# EAGLE schematic Motorsteuerung_v3 (EAGLE 9.6.0)
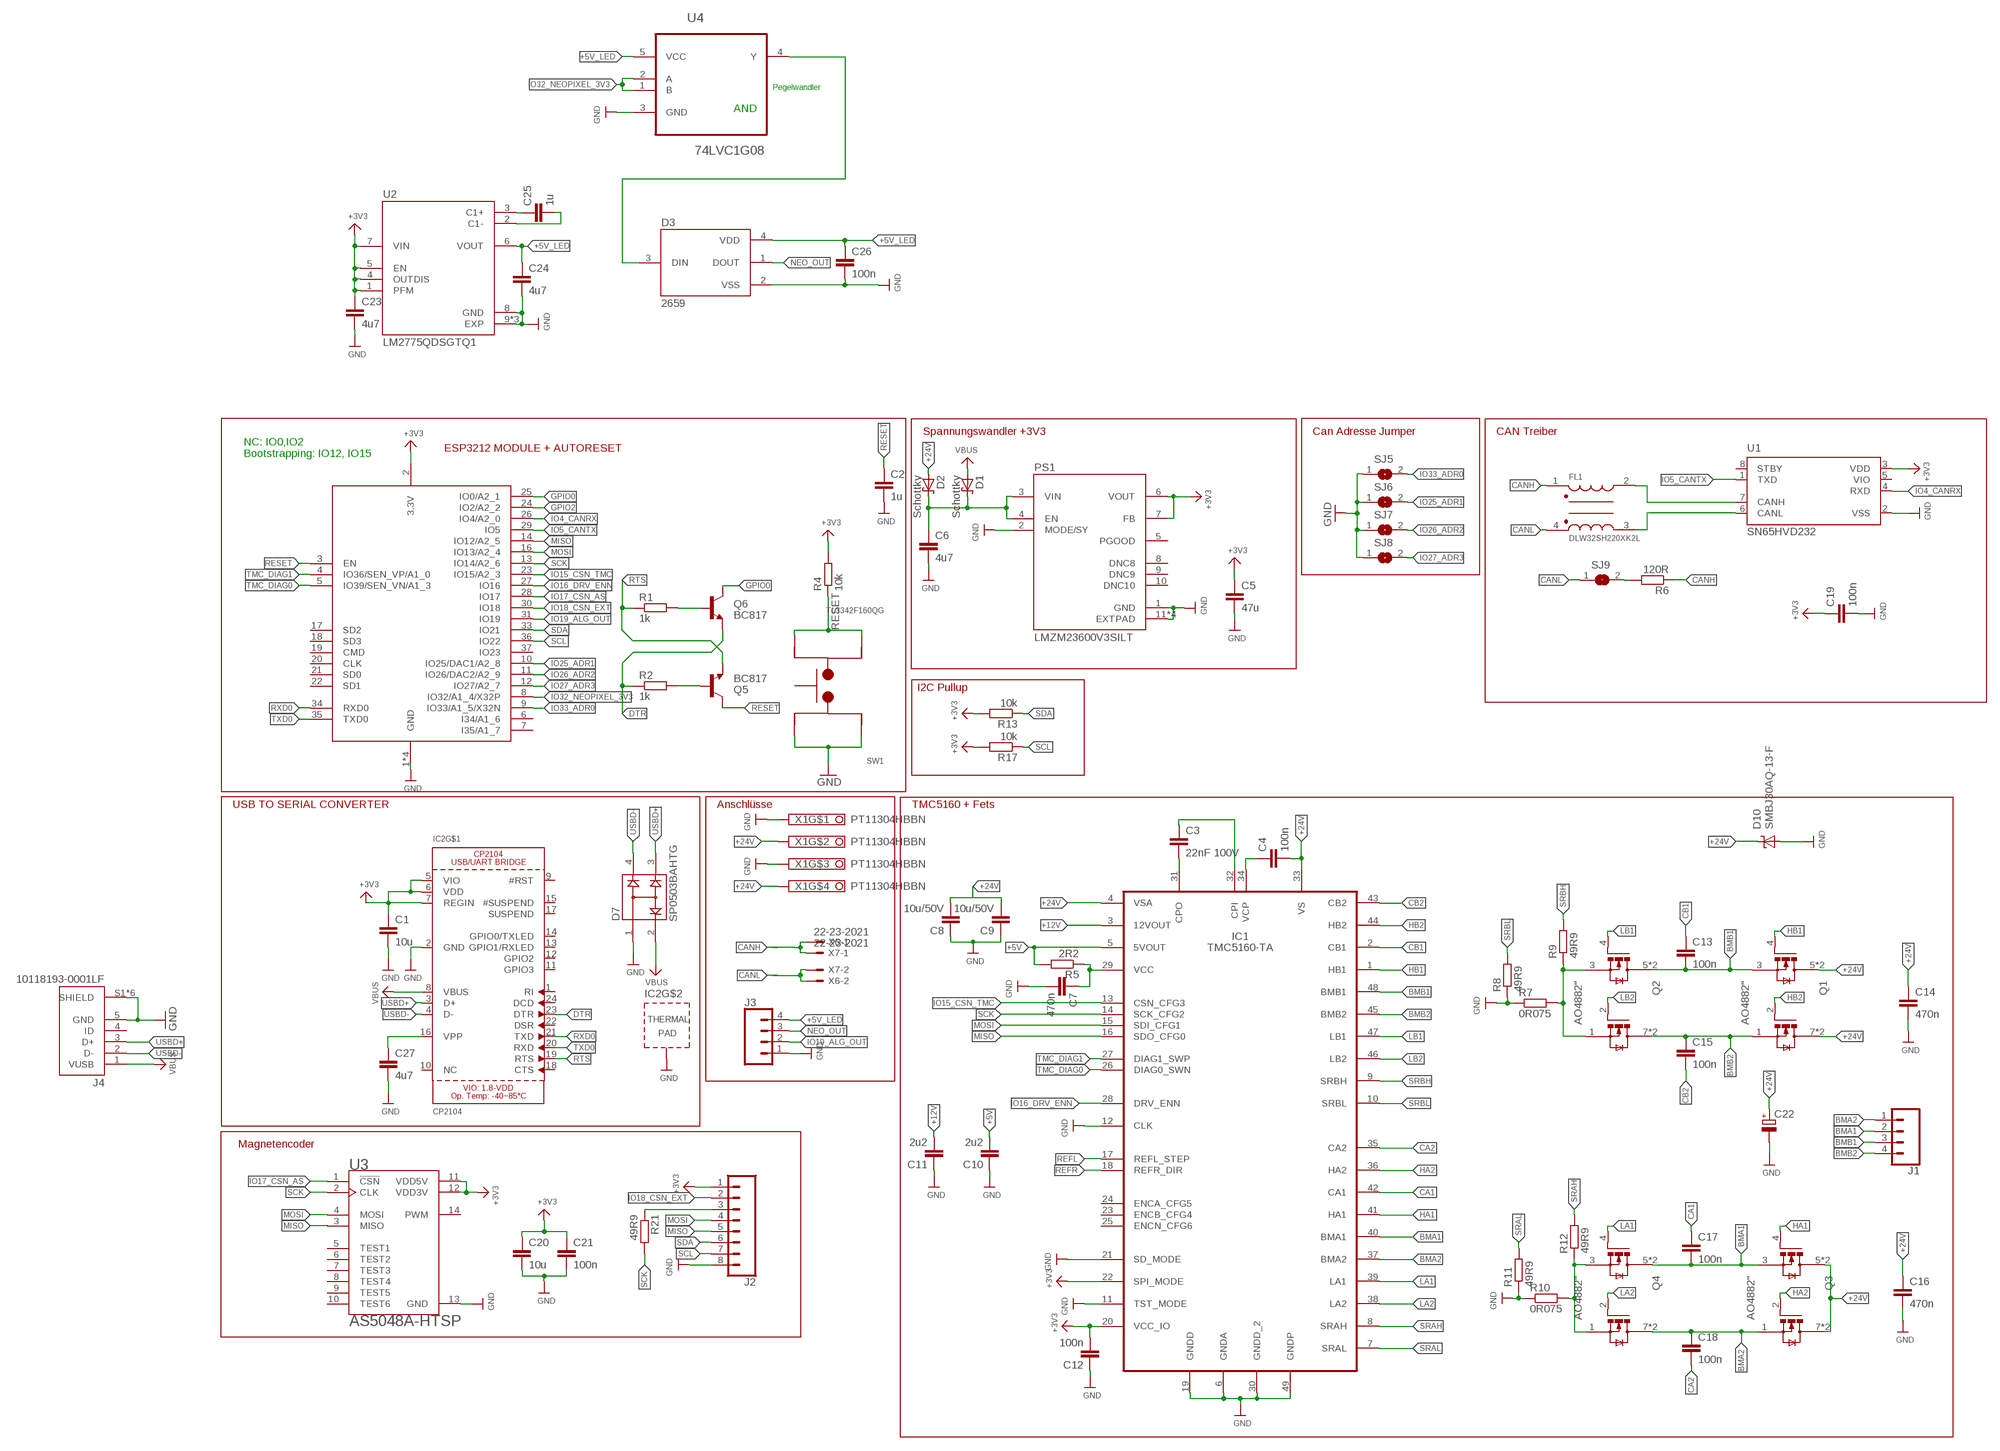
[diagram p0: schematic, sheet 1]

## Parts
C1  10u  C-EUC0805  [C0805]
C2  1u  C-EUC0805  [C0805]
C3  22nF 100V  C-EUC0805  [C0805]
C4  100n  C-EUC0805  [C0805]
C5  47u  C-EUC0805  [C0805]
C6  4u7  C-EUC0805  [C0805]
C7  470n  C-EUC0805  [C0805]
C8  10u/50V  C-EUC0805  [C0805]
C9  10u/50V  C-EUC0805  [C0805]
C10  2u2  C-EUC0805  [C0805]
C11  2u2  C-EUC0805  [C0805]
C12  100n  C-EUC0805  [C0805]
C13  100n  C-EUC0805  [C0805]
C14  470n  C-EUC0805  [C0805]
C15  100n  C-EUC0805  [C0805]
C16  470n  C-EUC0805  [C0805]
C17  100n  C-EUC0805  [C0805]
C18  100n  C-EUC0805  [C0805]
C19  100n  C-EUC0805  [C0805]
C20  10u  C-EUC0805  [C0805]
C21  100n  C-EUC0805  [C0805]
C22  CPOL-EUE5-10.5  [E5-10,5]
C23  4u7  C-EUC0805  [C0805]
C24  4u7  C-EUC0805  [C0805]
C25  1u  C-EUC0805  [C0805]
C26  100n  C-EUC0805  [C0805]
C27  4u7  C-EUC0805  [C0805]
D1  Schottky  SCHOTTKY-DIODESMD  [SMB]
D2  Schottky  SCHOTTKY-DIODESMD  [SMB]
D3  2659  [2659]
D7  SP0503BAHTG  [SOT143]
D10  SMBJ30AQ-13-F  SUPPRESSOR-SMBJ  [SMBJ]
FL1  DLW32SH220XK2L  DLW32SH110XK2L  [FIL_DLW32SH110XK2L]
IC1  TMC5160-TA  [TQFP48-EP]
IC2  CP2104  [QFN24_4MM_SMSC]
J1  CONN_04  [1X04]
J2  CONN_08BM08B-SRSS-TB  [BM08B-SRSS-TB]
J3  CONN_041.27MM  [1X04_1.27MM]
J4  10118193-0001LF  [FCI_10118193-0001LF]
PS1  LMZM23600V3SILT  [CONV_LMZM23600V3SILT]
Q1  AO4882"  [SOIC8]
Q2  AO4882"  [SOIC8]
Q3  AO4882"  [SOIC8]
Q4  AO4882"  [SOIC8]
Q5  BC817  TRANSISTOR_NPNSOT23-3  [SOT23-3]
Q6  BC817  TRANSISTOR_NPNSOT23-3  [SOT23-3]
R1  1k  R-EU_R0805  [R0805]
R2  1k  R-EU_R0805  [R0805]
R4  10k  R-EU_R0805  [R0805]
R5  2R2  R-EU_R0805  [R0805]
R6  120R  R-EU_R0805  [R0805]
R7  0R075  R-EU_R1206  [R1206]
R8  49R9  R-EU_R0805  [R0805]
R9  49R9  R-EU_R0805  [R0805]
R10  0R075  R-EU_R1206  [R1206]
R11  49R9  R-EU_R0805  [R0805]
R12  49R9  R-EU_R0805  [R0805]
R13  10k  R-EU_R0805  [R0805]
R17  10k  R-EU_R0805  [R0805]
R21  49R9  R-EU_R0805  [R0805]
SJ5  SJ  [SJ]
SJ6  SJ  [SJ]
SJ7  SJ  [SJ]
SJ8  SJ  [SJ]
SJ9  SJ  [SJ]
SW1  TL3342F160QG  [SW_TL3342F160QG]
U1  SN65HVD232  MCP2562-E/SN  [SOIC127P600X175-8N]
U2  LM2775QDSGTQ1  [SON50P200X200X80-9N]
U3  AS5048A-HTSP  [SOP65P640X120-14N]
U4  74LVC1G08  74LVC1G00GW  [SOT65P210X110-5N]
X1  PT11304HBBN  TYP184  [TYP184_FT]
X2  ESP32_WROOM32_SKINNY  [WROOM32_SKINNY]
X6  22-23-2021  [22-23-2021]
X7  22-23-2021  [22-23-2021]

## Nets
+3V3: C1.1 C5.1 C12.2 C19.1 C20.1 C21.1 C23.1 IC1.20(VCC_IO) IC1.22(SPI_MODE) IC2.5(VIO) IC2.6(VDD) IC2.7(REGIN) J2.1 PS1.6(VOUT) PS1.7(FB) R4.2 R13.2 R17.2 U1.3(VDD) U2.1(PFM) U2.4(OUTDIS) U2.5(EN) U2.7(VIN) U3.11(VDD5V) U3.12(VDD3V) X2.2(3.3V)
+5V: C10.2 IC1.5(5VOUT) R5.2
+5V_LED: C24.1 C26.1 D3.4(VDD) J3.4 U2.6(VOUT) U4.5(VCC)
+12V: C11.2 IC1.3(12VOUT)
+24V: C4.2 C8.2 C9.2 C14.1 C16.1 C22.+ D2.A D10.C IC1.4(VSA) IC1.33(VS) Q1.5(D1) Q1.6(D1) Q1.7(D2) Q1.8(D2) Q3.5(D1) Q3.6(D1) Q3.7(D2) Q3.8(D2) X1.2 X1.4
BMA1: C17.2 IC1.40(BMA1) J1.2 Q3.3(S1) Q4.5(D1) Q4.6(D1)
BMA2: C18.1 IC1.37(BMA2) J1.1 Q3.1(S2) Q4.7(D2) Q4.8(D2)
BMB1: C13.2 IC1.48(BMB1) J1.3 Q1.3(S1) Q2.5(D1) Q2.6(D1)
BMB2: C15.1 IC1.45(BMB2) J1.4 Q1.1(S2) Q2.7(D2) Q2.8(D2)
CA1: C17.1 IC1.42(CA1)
CA2: C18.2 IC1.35(CA2)
CANH: FL1.1 R6.1 X6.1 X7.1
CANL: FL1.4 SJ9.1 X6.2 X7.2
CB1: C13.1 IC1.2(CB1)
CB2: C15.2 IC1.43(CB2)
DTR: IC2.23(DTR) Q6.2(E) R2.1
GND: C1.2 C2.2 C5.2 C6.2 C7.2 C8.1 C9.1 C10.1 C11.1 C12.1 C14.2 C16.2 C19.2 C20.2 C21.2 C22.- C23.2 C24.2 C26.2 C27.2 D3.2(VSS) D7.1 D10.A IC1.6(GNDA) IC1.11(TST_MODE) IC1.12(CLK) IC1.19(GNDD) IC1.21(SD_MODE) IC1.30(GNDD_2) IC1.49(GNDP) IC2.2(GND) IC2.THERM(TP) J2.8 J3.1 J4.5(GND) J4.S1(SHIELD) J4.S2(SHIELD) J4.S3(SHIELD) J4.S4(SHIELD) J4.S5(SHIELD) J4.S6(SHIELD) PS1.1(GND) PS1.2(MODE/SY) PS1.11(EXTPAD) PS1.11_1(EXTPAD) PS1.11_2(EXTPAD) PS1.11_3(EXTPAD) R7.1 R8.1 R10.1 R11.1 SJ5.1 SJ6.1 SJ7.1 SJ8.1 SW1.3 SW1.4 U1.2(VSS) U2.8(GND) U2.9(EXP) U2.9_1(EXP) U2.9_2(EXP) U3.13(GND) U4.3(GND) X1.1 X1.3 X2.1(GND) X2.15(GND) X2.38(GND) X2.P$1(GND)
GPIO0: Q6.3(C) X2.25(IO0/A2_1)
GPIO2: X2.24(IO2/A2_2)
HA1: IC1.41(HA1) Q3.4(G1)
HA2: IC1.36(HA2) Q3.2(G2)
HB1: IC1.1(HB1) Q1.4(G1)
HB2: IC1.44(HB2) Q1.2(G2)
IO4_CANRX: U1.4(RXD) X2.26(IO4/A2_0)
IO5_CANTX: U1.1(TXD) X2.29(IO5)
IO15_CSN_TMC: IC1.13(CSN_CFG3) X2.23(IO15/A2_3)
IO16_DRV_ENN: IC1.28(DRV_ENN) X2.27(IO16)
IO17_CSN_AS: U3.1(!CSN) X2.28(IO17)
IO18_CSN_EXT: J2.2 X2.30(IO18)
IO19_ALG_OUT: J3.2 X2.31(IO19)
IO25_ADR1: SJ6.2 X2.10(IO25/DAC1/A2_8)
IO26_ADR2: SJ7.2 X2.11(IO26/DAC2/A2_9)
IO27_ADR3: SJ8.2 X2.12(IO27/A2_7)
IO32_NEOPIXEL_3V3: U4.1(B) U4.2(A) X2.8(IO32/A1_4/X32P)
IO33_ADR0: SJ5.2 X2.9(IO33/A1_5/X32N)
LA1: IC1.39(LA1) Q4.4(G1)
LA2: IC1.38(LA2) Q4.2(G2)
LB1: IC1.47(LB1) Q2.4(G1)
LB2: IC1.46(LB2) Q2.2(G2)
MISO: IC1.16(SDO_CFG0) J2.5 U3.3(MISO) X2.14(IO12/A2_5)
MOSI: IC1.15(SDI_CFG1) J2.4 U3.4(MOSI) X2.16(IO13/A2_4)
N$1: C25.1 U2.3(C1+)
N$2: C6.1 D1.C D2.C PS1.3(VIN) PS1.4(EN)
N$3: C3.2 IC1.31(CPO)
N$4: C3.1 IC1.32(CPI)
N$5: C4.1 IC1.34(VCP)
N$6: C25.2 U2.2(C1-)
N$7: C7.1 IC1.29(VCC) R5.1
N$8: FL1.2 U1.7(CANH)
N$9: Q4.1(S2) Q4.3(S1) R10.2 R12.1
N$10: Q2.1(S2) Q2.3(S1) R7.2 R9.1
N$11: FL1.3 U1.6(CANL)
N$12: Q5.1(B) R2.2
N$13: Q6.1(B) R1.2
N$15: D3.3(DIN) U4.4(Y)
N$16: R6.2 SJ9.2
N$21: J2.3 R21.1
N$22: C27.1 IC2.16(VPP)
NEO_OUT: D3.1(DOUT) J3.3
REFL: IC1.17(REFL_STEP)
REFR: IC1.18(REFR_DIR)
RESET: C2.1 Q5.3(C) R4.1 SW1.1 SW1.2 X2.3(EN)
RTS: IC2.19(RTS) Q5.2(E) R1.1
RXD0: IC2.21(TXD) X2.34(RXD0)
SCK: IC1.14(SCK_CFG2) R21.2 U3.2(CLK) X2.13(IO14/A2_6)
SCL: J2.7 R17.1 X2.36(IO22)
SDA: J2.6 R13.1 X2.33(IO21)
SRAH: IC1.8(SRAH) R12.2
SRAL: IC1.7(SRAL) R11.2
SRBH: IC1.9(SRBH) R9.2
SRBL: IC1.10(SRBL) R8.2
TMC_DIAG0: IC1.26(DIAG0_SWN) X2.5(IO39/SEN_VN/A1_3)
TMC_DIAG1: IC1.27(DIAG1_SWP) X2.4(IO36/SEN_VP/A1_0)
TXD0: IC2.20(RXD) X2.35(TXD0)
USBD+: D7.3 IC2.3(D+) J4.3(D+)
USBD-: D7.4 IC2.4(D-) J4.2(D-)
VBUS: D1.A D7.2 IC2.8(VBUS) J4.1(VUSB)
Unconnected: IC1.23(ENCB_CFG4) IC1.24(ENCA_CFG5) IC1.25(ENCN_CFG6) IC2.1(RI) IC2.9(#RST) IC2.10(NC) IC2.11(GPIO3) IC2.12(GPIO2) IC2.13(GPIO1/RXLED) IC2.14(GPIO0/TXLED) IC2.15(#SUSPEND) IC2.17(SUSPEND) IC2.18(CTS) IC2.22(DSR) IC2.24(DCD) J4.4(ID) PS1.5(PGOOD) PS1.8(DNC8) PS1.9(DNC9) PS1.10(DNC10) U1.8(STBY) U3.5(TEST1) U3.6(TEST2) U3.7(TEST3) U3.8(TEST4) U3.9(TEST5) U3.10(TEST6) U3.14(PWM) X2.6(I34/A1_6) X2.7(I35/A1_7) X2.17(SD2) X2.18(SD3) X2.19(CMD) X2.20(CLK) X2.21(SD0) X2.22(SD1) X2.37(IO23)

## Notes on the sheet
- Pegelwandler
- AND
- Spannungswandler +3V3 | Can Adresse Jumper | CAN Treiber
- ESP3212 MODULE + AUTORESET
- NC: IO0,IO2
  Bootstrapping: IO12, IO15
- I2C Pullup
- USB TO SERIAL CONVERTER | Anschlüsse | TMC5160 + Fets
- Magnetencoder

## Power pins joined to a net without a drawn wire
VIO: U1.5(VIO)

## Library data of the parts
C1-C21 C23-C27 = rcl:C-EU: CAPACITOR, European symbol; SPICEPREFIX: C
C22 = resistor:CPOL-EU: POLARIZED CAPACITOR, European symbol
D1 D2 = diode:SCHOTTKY-DIODE: Schottky Diode
D3 = 2659:2659: NeoPixel Mini 3535 RGB LEDs w/ Integrated Driver Chip - White; AVAILABILITY: Unavailable; DESCRIPTION: Addressable Lighting Neopixel 10 LED Discrete Serial _Shift Register_ Red, Green, Blue _RGB_ 3.50mm L x 3.50mm W; MF: Adafruit Industries; MP: 2659; PACKAGE: TQFP-32 Adafruit Industries; PRICE: None
D7 = SP0503BAHTG:SP0503BAHTG: TVS DIODE 5.5VWM 8.5VC SOT143; AVAILABILITY: Unavailable; DESCRIPTION: SP050xBA Series 8 V 30 pF Uni-Directional SMT TVS Avalanche Diode Array SOT-143; MF: Littelfuse Inc.; MP: SP0503BAHTG; PACKAGE: SOT-143 Littelfuse; PRICE: None
D10 = diode:SUPPRESSOR-: Suppressor diode
FL1 = DLW32SH110XK2L:DLW32SH110XK2L: 100UH-30%/+50% (AT 0.1MHZ) 150MA; AVAILABILITY: Unavailable; DESCRIPTION: 11µH @ 100kHz 2 Line Common Mode Choke Surface Mount 300mA DCR 400mOhm; MF: Murata; MP: DLW32SH110XK2L; PACKAGE: Horizontal-4 Murata; PRICE: None
IC1 = TMC5160-TA:TMC5160-TA: Universal high voltage controller for two-phase bipolar stepper motor. TQFP48-EP; AVAILABILITY: Unavailable; DESCRIPTION: Motor Driver, Stepper, Tqfp-48; MF: Trinamic Motion; MP: TMC5160-TA; PACKAGE: TQFP-48 Trinamic Motion; PRICE: None
IC2 = microbuilder:CP2104: CP2104 - USB to UART Bridge VDD Output: 3.45V
J1 = SparkFun-Connectors:CONN_04: Multi connection point. Often used as Generic Header-pin footprint for 0.1 inch spaced/style header connections On any of the 0.1 inch spaced packages, you can populate with these: Break Away Headers - Straight <https://www.sparkfun.com/products/116> (PRT-00116) Break Away Male Headers - Right Angle <https://www.sparkfun.com/products/553> (PRT-00553) Female Headers <https://www.sparkfun.com/products/115> (PRT-00115) Break Away Headers - Machine Pin <https://www.sparkfun.com/products/117> (PRT-00117) Break Away Female Headers - Swiss Machine Pin <https://www.sparkfun.com/products/743> (PRT-00743) For SCREWTERMINALS and SPRING TERMINALS visit here: Screw Terimnals on SparkFun.com <https://www.sparkfun.com/search/results?term=Screw+Terminals> (5mm/3.5mm/2.54mm spacing) This device is also useful as a general connection point to wire up your design to another part of your project. Our various solder wires solder well into these plated through hole pads. Hook-Up Wire - Assortment (Stranded, 22 AWG) <https://www.sparkfun.com/products/11375> (PRT-11375) Hook-Up Wire - Assortment (Solid Core, 22 AWG) <https://www.sparkfun.com/products/11367> (PRT-11367) View the entire wire category on our website here <https://www.sparkfun.com/categories/141> Special notes: Molex polarized connector foot print use with SKU : PRT-08231 with associated crimp pins and housings. 1MM SMD Version SKU: PRT-10208; PROD_ID: CONN-09696
J2 = SparkFun-Connectors:CONN_08: Multi connection point. Often used as Generic Header-pin footprint for 0.1 inch spaced/style header connections On any of the 0.1 inch spaced packages, you can populate with these: Break Away Headers - Straight <https://www.sparkfun.com/products/116> (PRT-00116) Break Away Male Headers - Right Angle <https://www.sparkfun.com/products/553> (PRT-00553) Female Headers <https://www.sparkfun.com/products/115> (PRT-00115) Break Away Headers - Machine Pin <https://www.sparkfun.com/products/117> (PRT-00117) Break Away Female Headers - Swiss Machine Pin <https://www.sparkfun.com/products/743> (PRT-00743) Arduino Stackable Header - 8 Pin <https://www.sparkfun.com/products/9279> (PRT-09279) For SCREWTERMINALS and SPRING TERMINALS visit here: Screw Terimnals on SparkFun.com <https://www.sparkfun.com/search/results?term=Screw+Terminals> (5mm/3.5mm/2.54mm spacing) This device is also useful as a general connection point to wire up your design to another part of your project. Our various solder wires solder well into these plated through hole pads. Hook-Up Wire - Assortment (Stranded, 22 AWG) <https://www.sparkfun.com/products/11375> (PRT-11375) Hook-Up Wire - Assortment (Solid Core, 22 AWG) <https://www.sparkfun.com/products/11367> (PRT-11367) View the entire wire category on our website here <https://www.sparkfun.com/categories/141> Special notes: Molex polarized connector foot print use with SKU : PRT-08231 with associated crimp pins and housings. 1MM SMD Version SKU: PRT-10208 NOTES ON THE VARIANTS LOCK and LOCK_LONGPADS... This footprint was designed to help hold the alignment of a through-hole component (i.e. 6-pin header) while soldering it into place. You may notice that each hole has been shifted either up or down by 0.005 of an inch from it's more standard position (which is a perfectly straight line). This slight alteration caused the pins (the squares in the middle) to touch the edges of the holes. Because they are alternating, it causes a "brace" to hold the component in place. 0.005 has proven to be the perfect amount of "off-center" position when using our standard breakaway headers. Although looks a little odd when you look at the bare footprint, once you have a header in there, the alteration is very hard to notice. Also,if you push a header all the way into place, it is covered up entirely on the bottom side.; PROD_ID: CONN-10556
J3 = SparkFun-Connectors:CONN_04: Multi connection point. Often used as Generic Header-pin footprint for 0.1 inch spaced/style header connections On any of the 0.1 inch spaced packages, you can populate with these: Break Away Headers - Straight <https://www.sparkfun.com/products/116> (PRT-00116) Break Away Male Headers - Right Angle <https://www.sparkfun.com/products/553> (PRT-00553) Female Headers <https://www.sparkfun.com/products/115> (PRT-00115) Break Away Headers - Machine Pin <https://www.sparkfun.com/products/117> (PRT-00117) Break Away Female Headers - Swiss Machine Pin <https://www.sparkfun.com/products/743> (PRT-00743) For SCREWTERMINALS and SPRING TERMINALS visit here: Screw Terimnals on SparkFun.com <https://www.sparkfun.com/search/results?term=Screw+Terminals> (5mm/3.5mm/2.54mm spacing) This device is also useful as a general connection point to wire up your design to another part of your project. Our various solder wires solder well into these plated through hole pads. Hook-Up Wire - Assortment (Stranded, 22 AWG) <https://www.sparkfun.com/products/11375> (PRT-11375) Hook-Up Wire - Assortment (Solid Core, 22 AWG) <https://www.sparkfun.com/products/11367> (PRT-11367) View the entire wire category on our website here <https://www.sparkfun.com/categories/141> Special notes: Molex polarized connector foot print use with SKU : PRT-08231 with associated crimp pins and housings. 1MM SMD Version SKU: PRT-10208
J4 = 10118193-0001LF:10118193-0001LF: Micro USB B Type Receptacle; AVAILABILITY: Unavailable; DESCRIPTION: USB - micro B USB 2.0 Receptacle Connector 5 Position Surface Mount, Right Angle; Through Hole; DIGIKEY-PURCHASE-URL: https://snapeda.com/shop?store=DigiKey&id=4800618; MF: Amphenol ICC (FCI); MOUSER-PURCHASE-URL: https://snapeda.com/shop?store=Mouser&id=4800618; MP: 10118193-0001LF; PACKAGE: None; PRICE: None
PS1 = LMZM23600V3SILT:LMZM23600V3SILT: 36-V, 0.5-A Step-Down DC/DC Power Module in 3.8-mm × 3-mm Package 10-uSiP -40 to 125; AVAILABILITY: Unavailable; DESCRIPTION: 36-V, 0.5-A Step-Down DC/DC Power Module in 3.8-mm × 3-mm Package 10-uSiP -40 to 125; MF: Texas Instruments; MP: LMZM23600V3SILT; PACKAGE: Module Texas Instruments; PRICE: None
Q1-Q4 = AO4882:AO4882: Dual N-Channel Power Trench® MOSFET 40 V, 12 A, 10 mΩ
Q5 Q6 = SparkFun:TRANSISTOR_NPN: Transistor NPN BJT configuration in SOT23 package. MMBT2222 is the common NPN we use. Double check BCE configuration again layout.
R1 R2 R4-R13 R17 R21 = rcl:R-EU_: RESISTOR, European symbol; SPICEPREFIX: R
SJ5-SJ9 = jumper:SJ: SMD solder JUMPER
SW1 = TL3342F160QG:TL3342F160QG: TL3342 Series SPST 1.6 N Round Button Gull Wing Surface Mount Tactile Switch; AVAILABILITY: Unavailable; DESCRIPTION: TL3342 Series SPST 1.6 N Round Button Gull Wing Surface Mount Tactile Switch; MF: E-Switch; MP: TL3342F160QG; PACKAGE: None; PRICE: None
U1 = MCP2562-E_SN:MCP2562-E/SN: MCP2562 Series 5 V Surface Mount High-Speed CAN Transceiver - SOIC-8; AVAILABILITY: Unavailable; DESCRIPTION: Microchip MCP2562-E/SN, CAN Transceiver 1MBps 1-channel IEC 61000-4-2, 8-Pin SOIC; MF: Microchip; MP: MCP2562-E/SN; PACKAGE: SO-8 Microchip; PRICE: None
U2 = LM2775QDSGTQ1:LM2775QDSGTQ1: IC REG CHARG PUMP 5V 200MA 8WSON; AVAILABILITY: Unavailable; DESCRIPTION: Charge Pump Switching Regulator IC Positive Fixed 5V 1 Output 200mA 8-WDFN Exposed Pad; MF: Texas Instruments; MP: LM2775QDSGTQ1; PACKAGE: WDFN-8 Texas Instruments; PRICE: None
U3 = AS5048A-HTSP:AS5048A-HTSP: AS5048B Series 360° 3.3 / 5 V 14 bit Magnetic Rotary Encoder - TSSOP-14; AVAILABILITY: Unavailable; DESCRIPTION: Ic Encoder Rotary 14-Tssop; MF: ams; MP: AS5048A-HTSP; PACKAGE: TSSOP-14 ams; PRICE: None
U4 = 74LVC1G00GW:74LVC1G00GW: Single 2-input NAND gate; AVAILABILITY: Unavailable; DESCRIPTION: NAND Gate 1-Element 2-IN CMOS 5-Pin TSSOP T/R; MF: Nexperia; MP: 74LVC1G00GW; PACKAGE: None; PRICE: None
X1 = MetzConnect182_183:TYP184
X2 = microbuilder:ESP32_WROOM32
X6 X7 = con-molex:22-23-2021: .100" (2.54mm) Center Header - 2 Pin; MF: MOLEX; MPN: 22-23-2021; OC_FARNELL: 1462926; OC_NEWARK: 25C3832

## Net classes
1 power: width 0.254 mm